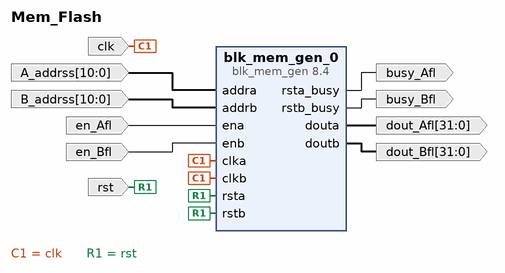
[diagram p0: block diagram of the top level]
# Vivado block design Mem_Flash, xc7z010clg400-1, Vivado 2022.2
create_bd_design Mem_Flash

create_bd_port -dir I rst
create_bd_port -dir I -from 10 -to 0 A_addrss
create_bd_port -dir I -from 10 -to 0 B_addrss
create_bd_port -dir I en_Afl
create_bd_port -dir I en_Bfl
create_bd_port -dir O busy_Afl
create_bd_port -dir O busy_Bfl
create_bd_port -dir O -from 31 -to 0 dout_Afl
create_bd_port -dir O -from 31 -to 0 dout_Bfl
create_bd_port -dir I clk

create_bd_cell -type ip -vlnv xilinx.com:ip:blk_mem_gen:8.4 blk_mem_gen_0
set_property -dict [list \
  CONFIG.Assume_Synchronous_Clk true \
  CONFIG.Coe_File ../../../../../../code/Counter.coe \
  CONFIG.Fill_Remaining_Memory_Locations true \
  CONFIG.Load_Init_File true \
  CONFIG.Memory_Type Dual_Port_ROM \
  CONFIG.Register_PortA_Output_of_Memory_Primitives false \
  CONFIG.Register_PortB_Output_of_Memory_Primitives false \
  CONFIG.Use_RSTA_Pin true \
  CONFIG.Use_RSTB_Pin true \
  CONFIG.Write_Depth_A 1040 \
  CONFIG.use_bram_block Stand_Alone \
] [get_bd_cells blk_mem_gen_0]

# ---- connections ----

connect_bd_net [get_bd_ports A_addrss] [get_bd_pins blk_mem_gen_0/addra]
connect_bd_net [get_bd_ports B_addrss] [get_bd_pins blk_mem_gen_0/addrb]
connect_bd_net [get_bd_pins blk_mem_gen_0/douta] [get_bd_ports dout_Afl]
connect_bd_net [get_bd_pins blk_mem_gen_0/doutb] [get_bd_ports dout_Bfl]
connect_bd_net [get_bd_pins blk_mem_gen_0/rsta_busy] [get_bd_ports busy_Afl]
connect_bd_net [get_bd_pins blk_mem_gen_0/rstb_busy] [get_bd_ports busy_Bfl]
connect_bd_net -net ckl_1 [get_bd_ports clk] [get_bd_pins blk_mem_gen_0/clka] [get_bd_pins blk_mem_gen_0/clkb]
connect_bd_net [get_bd_ports en_Afl] [get_bd_pins blk_mem_gen_0/ena]
connect_bd_net [get_bd_ports en_Bfl] [get_bd_pins blk_mem_gen_0/enb]
connect_bd_net [get_bd_ports rst] [get_bd_pins blk_mem_gen_0/rsta] [get_bd_pins blk_mem_gen_0/rstb]

validate_bd_design
save_bd_design
